# EAGLE design IO_board-ha-v2 (EAGLE 6.5.0)
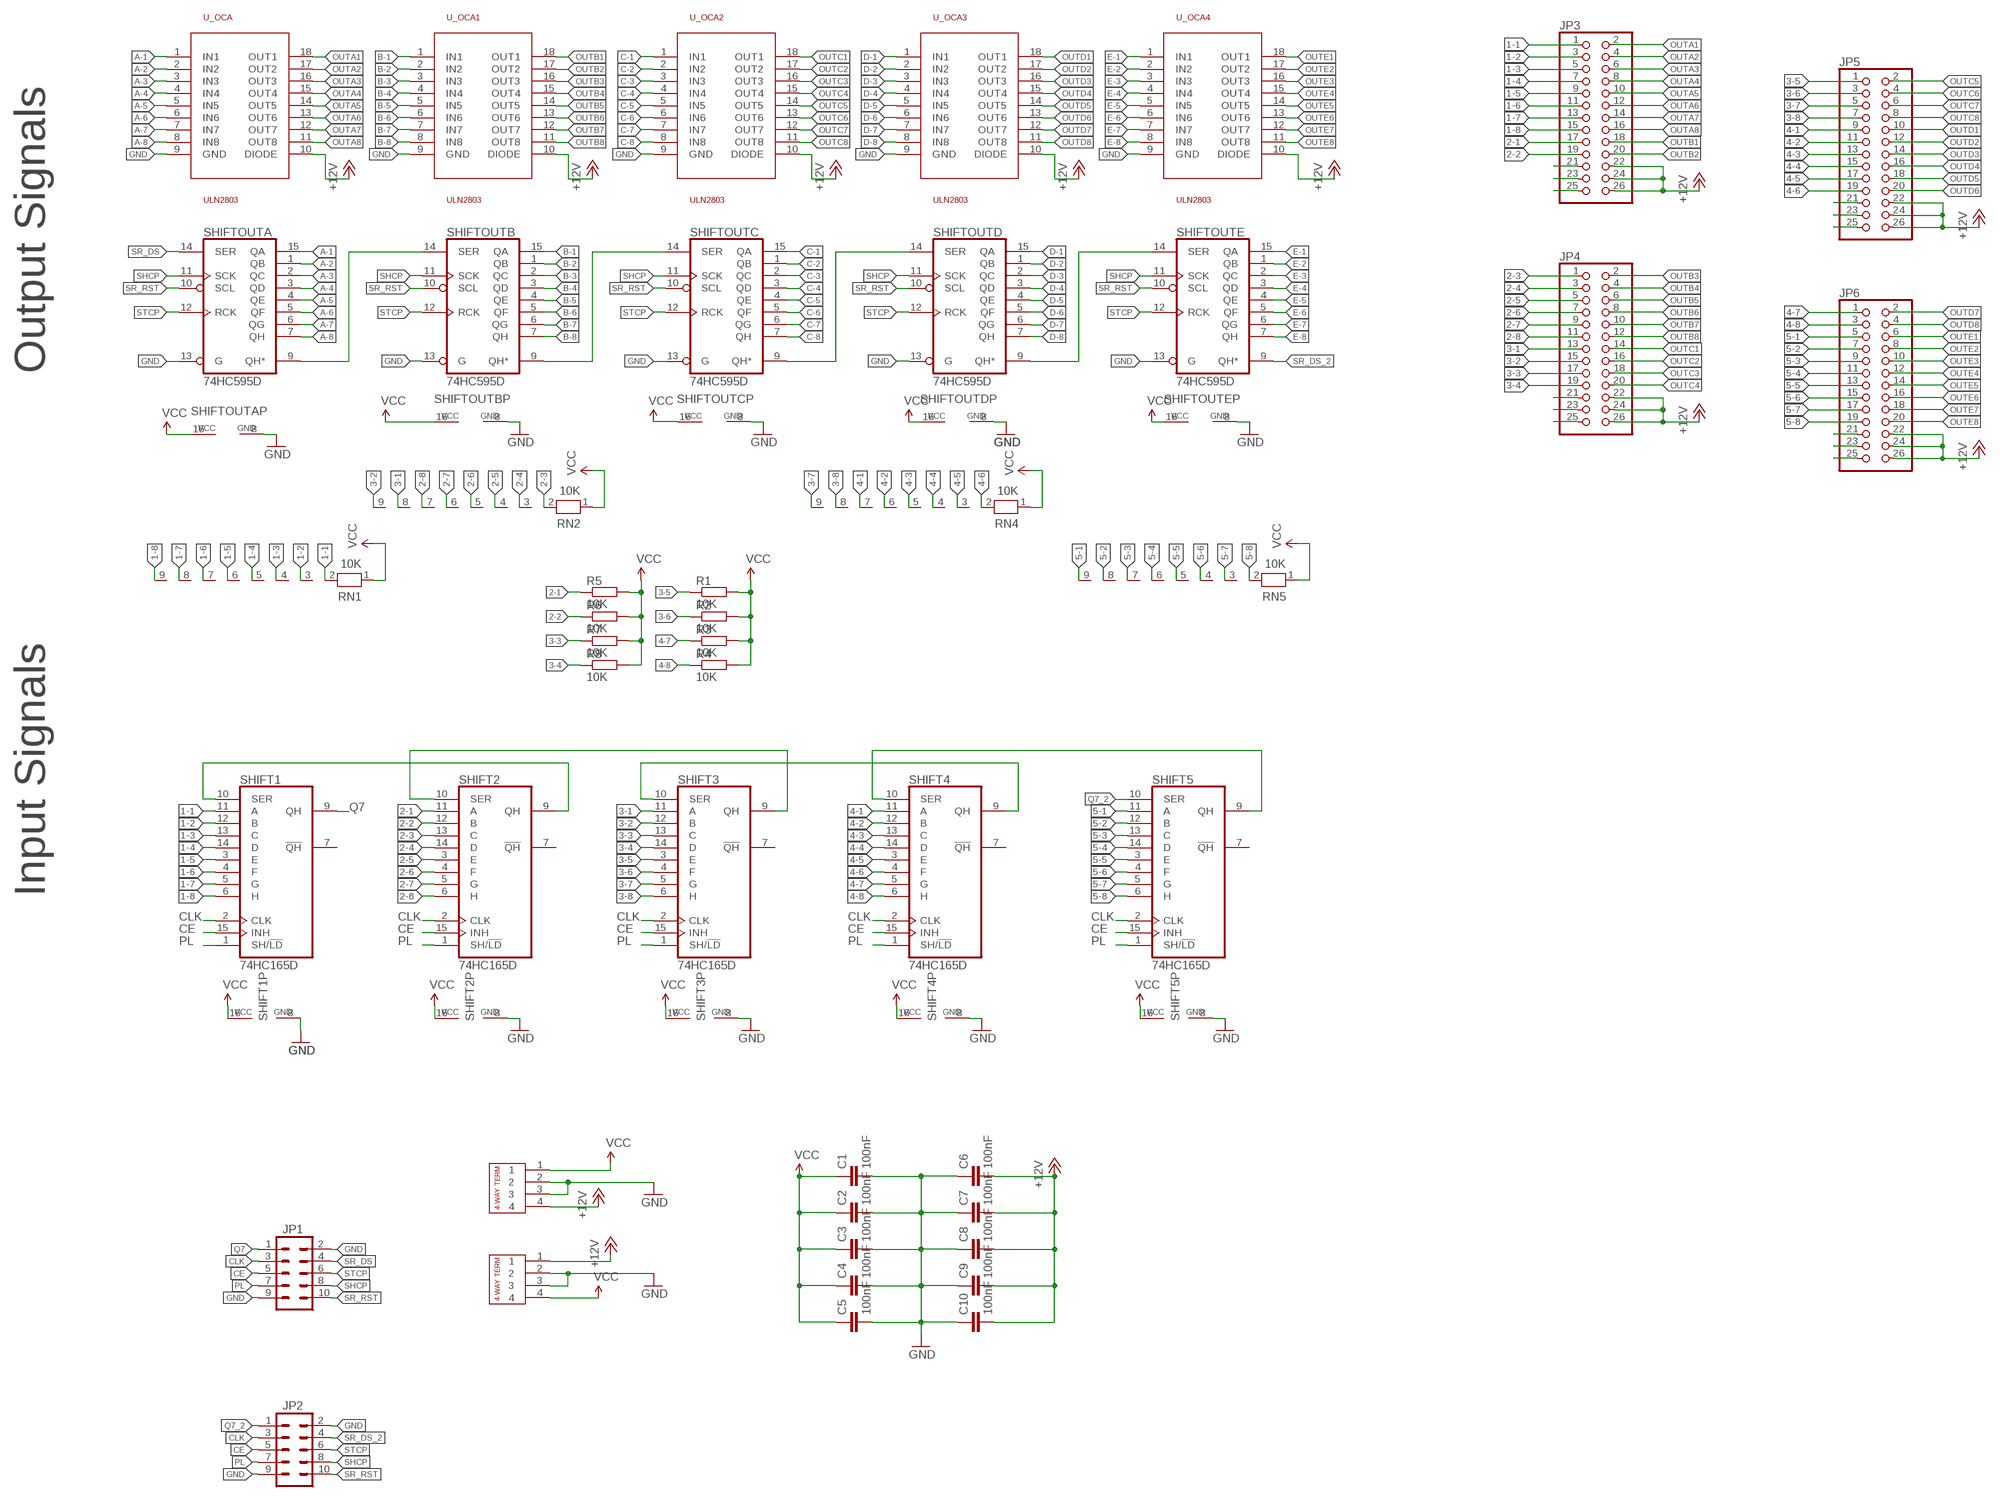
[diagram p0: schematic, sheet 1]

## Parts
C1  100nF  C-EUC0805  [C0805]
C2  100nF  C-EUC0805  [C0805]
C3  100nF  C-EUC0805  [C0805]
C4  100nF  C-EUC0805  [C0805]
C5  100nF  C-EUC0805  [C0805]
C6  100nF  C-EUC0805  [C0805]
C7  100nF  C-EUC0805  [C0805]
C8  100nF  C-EUC0805  [C0805]
C9  100nF  C-EUC0805  [C0805]
C10  100nF  C-EUC0805  [C0805]
J1  4-PIN-CON-1759017  [4-PIN-CON-1759017]
J2  4-PIN-CON-1759017  [4-PIN-CON-1759017]
JP1  M05X2SHD  [2X5-SHROUDED]
JP2  M05X2SHD  [2X5-SHROUDED]
JP3  PINHD-2X13  [2X13]
JP4  PINHD-2X13  [2X13]
JP5  PINHD-2X13  [2X13]
JP6  PINHD-2X13  [2X13]
R1  10K  R-EU_R0603  [R0603]
R2  10K  R-EU_R0603  [R0603]
R3  10K  R-EU_R0603  [R0603]
R4  10K  R-EU_R0603  [R0603]
R5  10K  R-EU_R0603  [R0603]
R6  10K  R-EU_R0603  [R0603]
R7  10K  R-EU_R0603  [R0603]
R8  10K  R-EU_R0603  [R0603]
RN1  10K  RN08  [RN-9]
RN2  10K  RN08  [RN-9]
RN4  10K  RN08  [RN-9]
RN5  10K  RN08  [RN-9]
SHIFT1  74HC165D  [SO16]
SHIFT2  74HC165D  [SO16]
SHIFT3  74HC165D  [SO16]
SHIFT4  74HC165D  [SO16]
SHIFT5  74HC165D  [SO16]
SHIFTOUTA  74HC595D  [SO16]
SHIFTOUTB  74HC595D  [SO16]
SHIFTOUTC  74HC595D  [SO16]
SHIFTOUTD  74HC595D  [SO16]
SHIFTOUTE  74HC595D  [SO16]
U_OCA  ULN2803  [SO18L]
U_OCA1  ULN2803  [SO18L]
U_OCA2  ULN2803  [SO18L]
U_OCA3  ULN2803  [SO18L]
U_OCA4  ULN2803  [SO18L]

## Nets
1-1: JP3.1 RN1.2 SHIFT1.11(A)
1-2: JP3.3 RN1.3 SHIFT1.12(B)
1-3: JP3.5 RN1.4 SHIFT1.13(C)
1-4: JP3.7 RN1.5 SHIFT1.14(D)
1-5: JP3.9 RN1.6 SHIFT1.3(E)
1-6: JP3.11 RN1.7 SHIFT1.4(F)
1-7: JP3.13 RN1.8 SHIFT1.5(G)
1-8: JP3.15 RN1.9 SHIFT1.6(H)
2-1: JP3.17 R5.1 SHIFT2.11(A)
2-2: JP3.19 R6.1 SHIFT2.12(B)
2-3: JP4.1 RN2.2 SHIFT2.13(C)
2-4: JP4.3 RN2.3 SHIFT2.14(D)
2-5: JP4.5 RN2.4 SHIFT2.3(E)
2-6: JP4.7 RN2.5 SHIFT2.4(F)
2-7: JP4.9 RN2.6 SHIFT2.5(G)
2-8: JP4.11 RN2.7 SHIFT2.6(H)
3-1: JP4.13 RN2.8 SHIFT3.11(A)
3-2: JP4.15 RN2.9 SHIFT3.12(B)
3-3: JP4.17 R7.1 SHIFT3.13(C)
3-4: JP4.19 R8.1 SHIFT3.14(D)
3-5: JP5.1 R1.1 SHIFT3.3(E)
3-6: JP5.3 R2.1 SHIFT3.4(F)
3-7: JP5.5 RN4.9 SHIFT3.5(G)
3-8: JP5.7 RN4.8 SHIFT3.6(H)
4-1: JP5.9 RN4.7 SHIFT4.11(A)
4-2: JP5.11 RN4.6 SHIFT4.12(B)
4-3: JP5.13 RN4.5 SHIFT4.13(C)
4-4: JP5.15 RN4.4 SHIFT4.14(D)
4-5: JP5.17 RN4.3 SHIFT4.3(E)
4-6: JP5.19 RN4.2 SHIFT4.4(F)
4-7: JP6.1 R3.1 SHIFT4.5(G)
4-8: JP6.3 R4.1 SHIFT4.6(H)
5-1: JP6.5 RN5.9 SHIFT5.11(A)
5-2: JP6.7 RN5.8 SHIFT5.12(B)
5-3: JP6.9 RN5.7 SHIFT5.13(C)
5-4: JP6.11 RN5.6 SHIFT5.14(D)
5-5: JP6.13 RN5.5 SHIFT5.3(E)
5-6: JP6.15 RN5.4 SHIFT5.4(F)
5-7: JP6.17 RN5.3 SHIFT5.5(G)
5-8: JP6.19 RN5.2 SHIFT5.6(H)
+12V [power]: C6.2 C7.2 C8.2 C9.2 C10.2 J1.4 J2.1 JP3.22 JP3.24 JP3.26 JP4.22 JP4.24 JP4.26 JP5.22 JP5.24 JP5.26 JP6.22 JP6.24 JP6.26 U_OCA1.10(DIODE) U_OCA2.10(DIODE) U_OCA3.10(DIODE) U_OCA4.10(DIODE) U_OCA.10(DIODE)
A-1: SHIFTOUTA.15(QA) U_OCA.1(IN1)
A-2: SHIFTOUTA.1(QB) U_OCA.2(IN2)
A-3: SHIFTOUTA.2(QC) U_OCA.3(IN3)
A-4: SHIFTOUTA.3(QD) U_OCA.4(IN4)
A-5: SHIFTOUTA.4(QE) U_OCA.5(IN5)
A-6: SHIFTOUTA.5(QF) U_OCA.6(IN6)
A-7: SHIFTOUTA.6(QG) U_OCA.7(IN7)
A-8: SHIFTOUTA.7(QH) U_OCA.8(IN8)
B-1: SHIFTOUTB.15(QA) U_OCA1.1(IN1)
B-2: SHIFTOUTB.1(QB) U_OCA1.2(IN2)
B-3: SHIFTOUTB.2(QC) U_OCA1.3(IN3)
B-4: SHIFTOUTB.3(QD) U_OCA1.4(IN4)
B-5: SHIFTOUTB.4(QE) U_OCA1.5(IN5)
B-6: SHIFTOUTB.5(QF) U_OCA1.6(IN6)
B-7: SHIFTOUTB.6(QG) U_OCA1.7(IN7)
B-8: SHIFTOUTB.7(QH) U_OCA1.8(IN8)
C-1: SHIFTOUTC.15(QA) U_OCA2.1(IN1)
C-2: SHIFTOUTC.1(QB) U_OCA2.2(IN2)
C-3: SHIFTOUTC.2(QC) U_OCA2.3(IN3)
C-4: SHIFTOUTC.3(QD) U_OCA2.4(IN4)
C-5: SHIFTOUTC.4(QE) U_OCA2.5(IN5)
C-6: SHIFTOUTC.5(QF) U_OCA2.6(IN6)
C-7: SHIFTOUTC.6(QG) U_OCA2.7(IN7)
C-8: SHIFTOUTC.7(QH) U_OCA2.8(IN8)
CE: JP1.5 JP2.5 SHIFT1.15(INH) SHIFT2.15(INH) SHIFT3.15(INH) SHIFT4.15(INH) SHIFT5.15(INH)
CLK: JP1.3 JP2.3 SHIFT1.2(CLK) SHIFT2.2(CLK) SHIFT3.2(CLK) SHIFT4.2(CLK) SHIFT5.2(CLK)
D-1: SHIFTOUTD.15(QA) U_OCA3.1(IN1)
D-2: SHIFTOUTD.1(QB) U_OCA3.2(IN2)
D-3: SHIFTOUTD.2(QC) U_OCA3.3(IN3)
D-4: SHIFTOUTD.3(QD) U_OCA3.4(IN4)
D-5: SHIFTOUTD.4(QE) U_OCA3.5(IN5)
D-6: SHIFTOUTD.5(QF) U_OCA3.6(IN6)
D-7: SHIFTOUTD.6(QG) U_OCA3.7(IN7)
D-8: SHIFTOUTD.7(QH) U_OCA3.8(IN8)
E-1: SHIFTOUTE.15(QA) U_OCA4.1(IN1)
E-2: SHIFTOUTE.1(QB) U_OCA4.2(IN2)
E-3: SHIFTOUTE.2(QC) U_OCA4.3(IN3)
E-4: SHIFTOUTE.3(QD) U_OCA4.4(IN4)
E-5: SHIFTOUTE.4(QE) U_OCA4.5(IN5)
E-6: SHIFTOUTE.5(QF) U_OCA4.6(IN6)
E-7: SHIFTOUTE.6(QG) U_OCA4.7(IN7)
E-8: SHIFTOUTE.7(QH) U_OCA4.8(IN8)
GND [GND]: C1.2 C2.2 C3.2 C4.2 C5.2 C6.1 C7.1 C8.1 C9.1 C10.1 J1.2 J1.3 J2.2 J2.3 JP1.2 JP1.9 JP2.2 JP2.9 JP3.21 JP3.23 JP3.25 JP4.21 JP4.23 JP4.25 JP5.21 JP5.23 JP5.25 JP6.21 JP6.23 JP6.25 SHIFT1.8(GND) SHIFT2.8(GND) SHIFT3.8(GND) SHIFT4.8(GND) SHIFT5.8(GND) SHIFTOUTA.8(GND) SHIFTOUTA.13(G) SHIFTOUTB.8(GND) SHIFTOUTB.13(G) SHIFTOUTC.8(GND) SHIFTOUTC.13(G) SHIFTOUTD.8(GND) SHIFTOUTD.13(G) SHIFTOUTE.8(GND) SHIFTOUTE.13(G) U_OCA1.9(GND) U_OCA2.9(GND) U_OCA3.9(GND) U_OCA4.9(GND) U_OCA.9(GND)
N$18: SHIFT2.10(SER) SHIFT3.9(QH)
N$21: SHIFT3.10(SER) SHIFT4.9(QH)
N$22: SHIFT4.10(SER) SHIFT5.9(QH)
N$26: SHIFTOUTA.9(QH*) SHIFTOUTB.14(SER)
N$31: SHIFTOUTC.9(QH*) SHIFTOUTD.14(SER)
N$37: SHIFTOUTB.9(QH*) SHIFTOUTC.14(SER)
N$38: SHIFTOUTD.9(QH*) SHIFTOUTE.14(SER)
N$50: SHIFT1.10(SER) SHIFT2.9(QH)
OUTA1: JP3.2 U_OCA.18(OUT1)
OUTA2: JP3.4 U_OCA.17(OUT2)
OUTA3: JP3.6 U_OCA.16(OUT3)
OUTA4: JP3.8 U_OCA.15(OUT4)
OUTA5: JP3.10 U_OCA.14(OUT5)
OUTA6: JP3.12 U_OCA.13(OUT6)
OUTA7: JP3.14 U_OCA.12(OUT7)
OUTA8: JP3.16 U_OCA.11(OUT8)
OUTB1: JP3.18 U_OCA1.18(OUT1)
OUTB2: JP3.20 U_OCA1.17(OUT2)
OUTB3: JP4.2 U_OCA1.16(OUT3)
OUTB4: JP4.4 U_OCA1.15(OUT4)
OUTB5: JP4.6 U_OCA1.14(OUT5)
OUTB6: JP4.8 U_OCA1.13(OUT6)
OUTB7: JP4.10 U_OCA1.12(OUT7)
OUTB8: JP4.12 U_OCA1.11(OUT8)
OUTC1: JP4.14 U_OCA2.18(OUT1)
OUTC2: JP4.16 U_OCA2.17(OUT2)
OUTC3: JP4.18 U_OCA2.16(OUT3)
OUTC4: JP4.20 U_OCA2.15(OUT4)
OUTC5: JP5.2 U_OCA2.14(OUT5)
OUTC6: JP5.4 U_OCA2.13(OUT6)
OUTC7: JP5.6 U_OCA2.12(OUT7)
OUTC8: JP5.8 U_OCA2.11(OUT8)
OUTD1: JP5.10 U_OCA3.18(OUT1)
OUTD2: JP5.12 U_OCA3.17(OUT2)
OUTD3: JP5.14 U_OCA3.16(OUT3)
OUTD4: JP5.16 U_OCA3.15(OUT4)
OUTD5: JP5.18 U_OCA3.14(OUT5)
OUTD6: JP5.20 U_OCA3.13(OUT6)
OUTD7: JP6.2 U_OCA3.12(OUT7)
OUTD8: JP6.4 U_OCA3.11(OUT8)
OUTE1: JP6.6 U_OCA4.18(OUT1)
OUTE2: JP6.8 U_OCA4.17(OUT2)
OUTE3: JP6.10 U_OCA4.16(OUT3)
OUTE4: JP6.12 U_OCA4.15(OUT4)
OUTE5: JP6.14 U_OCA4.14(OUT5)
OUTE6: JP6.16 U_OCA4.13(OUT6)
OUTE7: JP6.18 U_OCA4.12(OUT7)
OUTE8: JP6.20 U_OCA4.11(OUT8)
PL: JP1.7 JP2.7 SHIFT1.1(SH/!LD) SHIFT2.1(SH/!LD) SHIFT3.1(SH/!LD) SHIFT4.1(SH/!LD) SHIFT5.1(SH/!LD)
Q7: JP1.1 SHIFT1.9(QH)
Q7_2: JP2.1 SHIFT5.10(SER)
SHCP: JP1.8 JP2.8 SHIFTOUTA.11(SCK) SHIFTOUTB.11(SCK) SHIFTOUTC.11(SCK) SHIFTOUTD.11(SCK) SHIFTOUTE.11(SCK)
SR_DS: JP1.4 SHIFTOUTA.14(SER)
SR_DS_2: JP2.4 SHIFTOUTE.9(QH*)
SR_RST: JP1.10 JP2.10 SHIFTOUTA.10(SCL) SHIFTOUTB.10(SCL) SHIFTOUTC.10(SCL) SHIFTOUTD.10(SCL) SHIFTOUTE.10(SCL)
STCP: JP1.6 JP2.6 SHIFTOUTA.12(RCK) SHIFTOUTB.12(RCK) SHIFTOUTC.12(RCK) SHIFTOUTD.12(RCK) SHIFTOUTE.12(RCK)
VCC [power]: C1.1 C2.1 C3.1 C4.1 C5.1 J1.1 J2.4 R1.2 R2.2 R3.2 R4.2 R5.2 R6.2 R7.2 R8.2 RN1.1 RN2.1 RN4.1 RN5.1 SHIFT1.16(VCC) SHIFT2.16(VCC) SHIFT3.16(VCC) SHIFT4.16(VCC) SHIFT5.16(VCC) SHIFTOUTA.16(VCC) SHIFTOUTB.16(VCC) SHIFTOUTC.16(VCC) SHIFTOUTD.16(VCC) SHIFTOUTE.16(VCC)
Unconnected: SHIFT1.7(!QH) SHIFT2.7(!QH) SHIFT3.7(!QH) SHIFT4.7(!QH) SHIFT5.7(!QH)

## Notes on the sheet
- Output Signals
- Input Signals

## Library data of the parts
C1-C10 = resistor:C-EU: CAPACITOR, European symbol
J1 J2 = maul:4-PIN-CON-1759017
JP1 JP2 = SparkFun-Connectors:M05X2: Header 5x2 Standard 10-pin dual row 0.1" header. Commonly used with AVR-ISP. Use with Spark Fun Electronics SKU: PRT-00778
JP3-JP6 = pinhead:PINHD-2X13: PIN HEADER
R1-R8 = resistor:R-EU_: RESISTOR, European symbol
RN1 RN2 RN4 RN5 = resistor-net:RN08: RESISTOR NETWORK; OC_FARNELL: unknown; OC_NEWARK: unknown
SHIFT1-SHIFT5 = 74xx-eu:74*165: 8-bit parallel load SHIFT REGISTER
SHIFTOUTA SHIFTOUTB SHIFTOUTC SHIFTOUTD SHIFTOUTE = 74xx-eu:74*595: 8-bit SHIFT REGISTER, output latch
U_OCA U_OCA1-U_OCA4 = uln2803:ULN2803

## Net classes
1 power: width 0.305 mm, drill 0.6 mm, clearance 0.813 mm
2 GND: width 0.305 mm, drill 0.6 mm, clearance 0.508 mm
3 LIVEAC: width 0.508 mm, drill 0.508 mm, clearance 1.27 mm

## Board
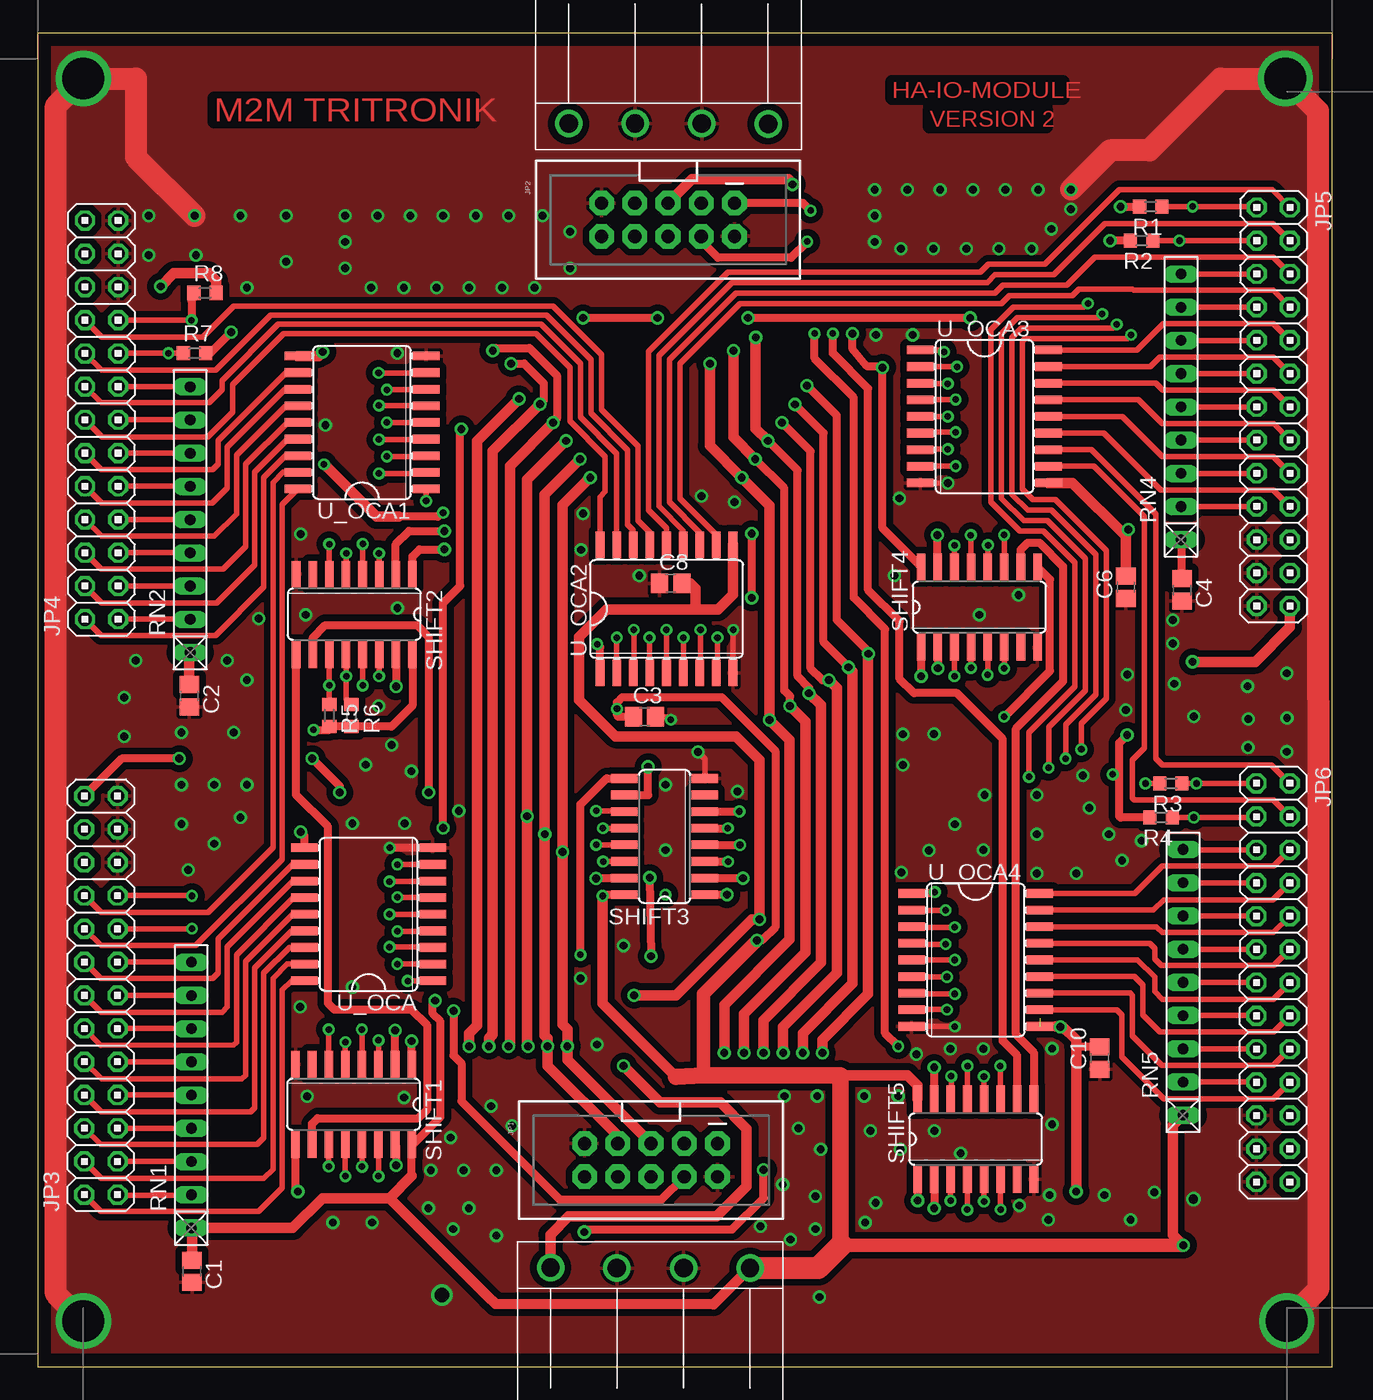
[diagram p1: board, top side]
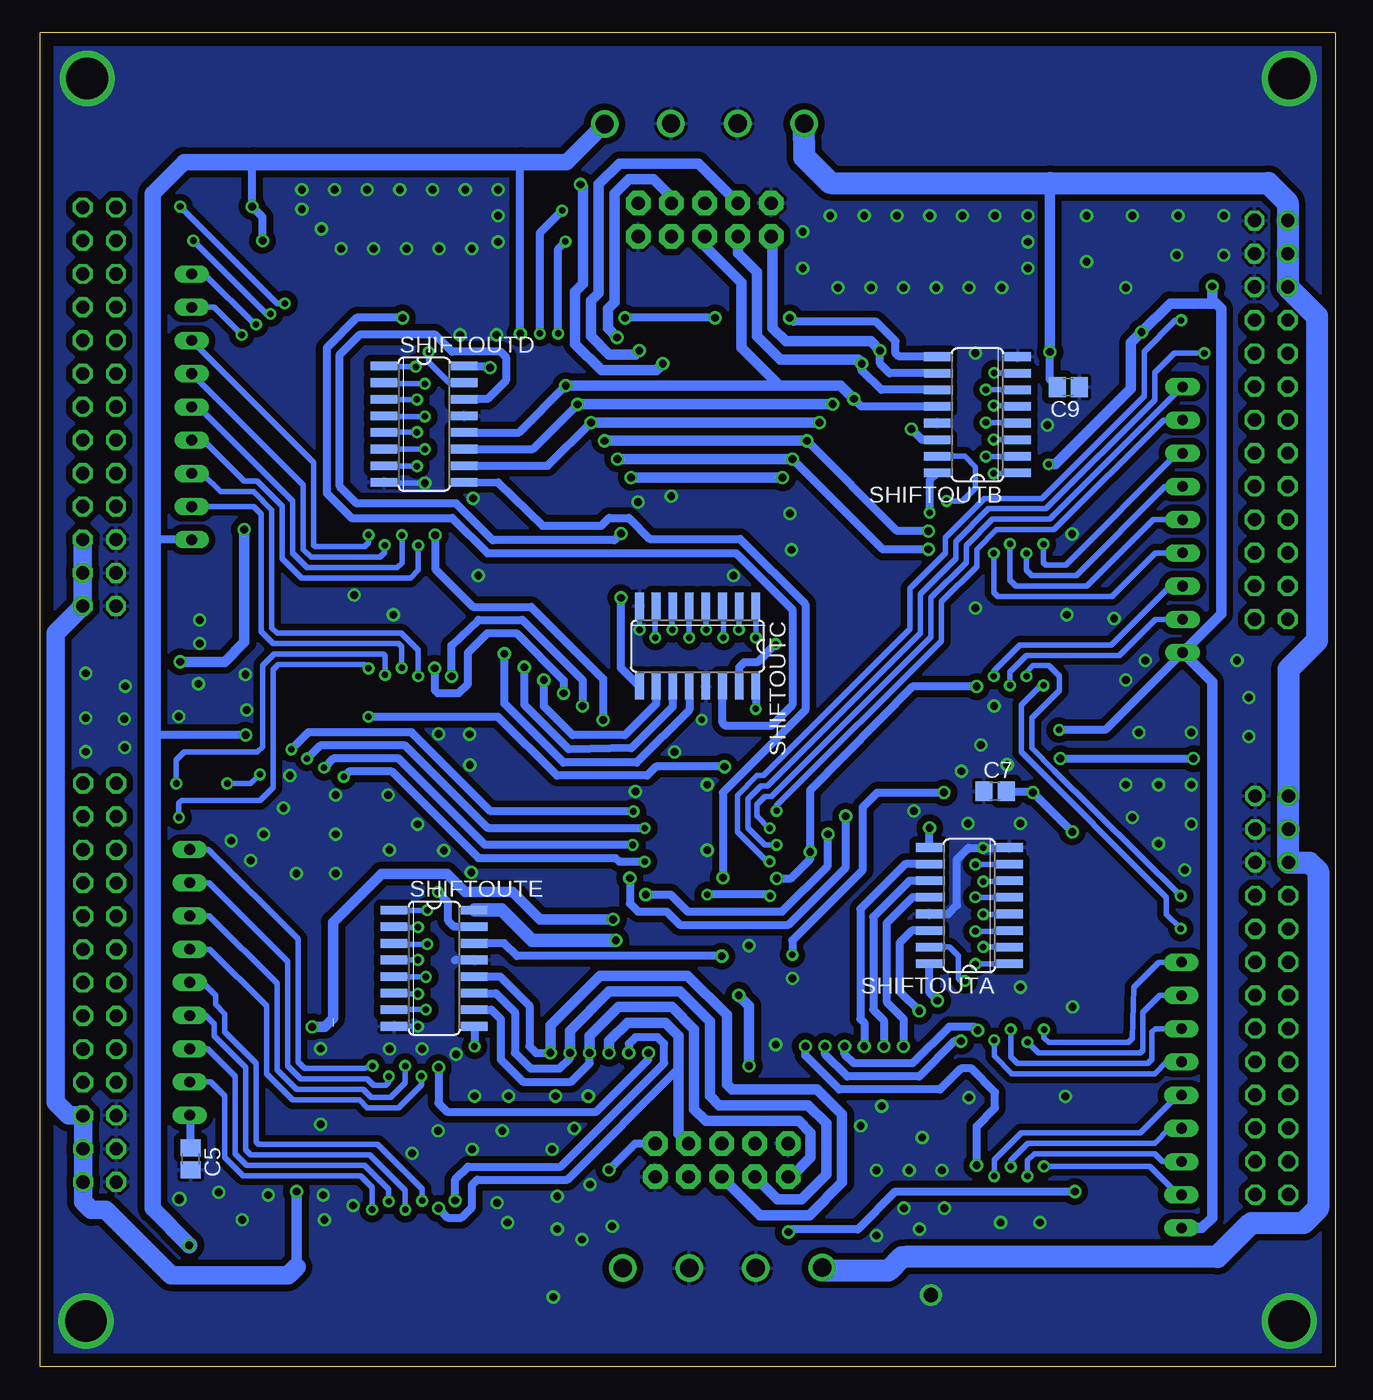
[diagram p2: board, bottom side, seen from below]

Size 99 x 102 mm. Coordinates in mm from the lower left corner, seen from the top.
Outline: 99,0 99,102 0,102 0,0 99,0
Copper layers (1*16): Top 0.035mm / dielectric 1.5mm / Bottom 0.035mm
Design rules "default": minimum track width 10mil, minimum drill 24mil, track to track 8mil, track to pad 8mil, pad to pad 8mil, via to via 8mil, smd to smd 8mil, copper to edge 40mil, drill to drill 8mil, minimum pad ring 10mil, minimum via ring 8mil, stop-mask expansion 4mil, vias tented up to drill 0mil, thermal gap 10mil

### Footprints (pad centres in the part's own frame; a part is rotated, then mirrored left to right if it is on the bottom)
C0805 = smd 1.3 x 1.5: 1 -0.85,0; 2 0.85,0
4-PIN-CON-1759017 = drill 1.4: 1 -7.62,4.13; 2 -2.55,4.1; 3 2.55,4.1; 4 7.63,4.1
2X5-SHROUDED = drill 1.016 pad 1.88 octagon: 1 -1.27,5.08; 2 1.27,5.08; 3 -1.27,2.54; 4 1.27,2.54; 5 -1.27,0; 6 1.27,0; 7 -1.27,-2.54; 8 1.27,-2.54; 9 -1.27,-5.08; 10 1.27,-5.08
2X13 = drill 1.016 octagon: 1 -15.24,-1.27; 2 -15.24,1.27; 3 -12.7,-1.27; 4 -12.7,1.27; 5 -10.16,-1.27; 6 -10.16,1.27; 7 -7.62,-1.27; 8 -7.62,1.27; 9 -5.08,-1.27; 10 -5.08,1.27; 11 -2.54,-1.27; 12 -2.54,1.27; 13 0,-1.27; 14 0,1.27; 15 2.54,-1.27; 16 2.54,1.27; 17 5.08,-1.27; 18 5.08,1.27; 19 7.62,-1.27; 20 7.62,1.27; 21 10.16,-1.27; 22 10.16,1.27; 23 12.7,-1.27; 24 12.7,1.27; 25 15.24,-1.27; 26 15.24,1.27
R0603 = smd 1 x 1.1: 1 -0.85,0; 2 0.85,0
RN-9 = drill 0.813 long: 1 -10.16,0; 2 -7.62,0; 3 -5.08,0; 4 -2.54,0; 5 0,0; 6 2.54,0; 7 5.08,0; 8 7.62,0; 9 10.16,0
SO16 = smd 0.66 x 2.032: 1 -4.445,-3.073; 2 -3.175,-3.073; 3 -1.905,-3.073; 4 -0.635,-3.073; 5 0.635,-3.073; 6 1.905,-3.073; 7 3.175,-3.073; 8 4.445,-3.073; 9 4.445,3.073; 10 3.175,3.073; 11 1.905,3.073; 12 0.635,3.073; 13 -0.635,3.073; 14 -1.905,3.073; 15 -3.175,3.073; 16 -4.445,3.073
SO18L = smd 0.66 x 2.032: 1 -5.08,-4.902; 2 -3.81,-4.902; 3 -2.54,-4.902; 4 -1.27,-4.902; 5 0,-4.902; 6 1.27,-4.902; 7 2.54,-4.902; 8 3.81,-4.902; 9 5.08,-4.902; 10 5.08,4.902; 11 3.81,4.902; 12 2.54,4.902; 13 1.27,4.902; 14 0,4.902; 15 -1.27,4.902; 16 -2.54,4.902; 17 -3.81,4.902; 18 -5.08,4.902

### Placement (x,y rotation side)
C1  11.8,7.3 270 top
C2  11.6,51.3 270 top
C3  46.4,49.7 0 top
C4  87.5,59.4 270 top
C5  87.5,15.9 270 bottom
C6  83.2,59.6 90 top
C7  26,44 0 bottom
C8  48.4,59.9 0 top
C9  20.4,74.9 180 bottom
C10  81.2,23.6 90 top
J1  48.23,99.15 180 top
J2  46.84,3.45 0 top
JP1  46.9,15.8 270 top
JP2  48.2,87.7 270 top
JP3  4.84,28.4 90 top
JP4  4.89,72.4 90 top
JP5  94.48,73.4 270 top
JP6  94.46,29.37 270 top
R1  85.1,88.7 180 top
R2  84.4,86.1 180 top
R3  86.64,44.6 180 top
R4  85.9,42 180 top
R5  22.3,49.8 270 top
R6  24,49.8 270 top
R7  12,77.5 0 top
R8  12.8,82.1 0 top
RN1  11.75,20.77 90 top
RN2  11.66,64.77 90 top
RN4  87.42,73.39 90 top
RN5  87.57,29.39 90 top
SHIFT1  24.16,20.06 180 top
SHIFT2  24.21,57.53 180 top
SHIFT3  47.94,40.54 90 top
SHIFT4  72,58.08 0 top
SHIFT5  71.72,17.41 0 top
SHIFTOUTA  27.96,35.26 90 bottom
SHIFTOUTB  27.34,72.79 90 bottom
SHIFTOUTC  48.74,55.09 180 bottom
SHIFTOUTD  69.65,72.07 270 bottom
SHIFTOUTE  68.88,30.47 270 bottom
U_OCA  25.3,34.6 90 top
U_OCA1  24.8,72.2 90 top
U_OCA2  48.08,57.95 0 top
U_OCA3  72.39,72.66 270 top
U_OCA4  71.72,31.11 270 top

### Tracks (layer width: path | path; a pad name or v marks a point on that pad's centre or on a via)
1-1  (via drill 0.5)
  Top 0.406: SHIFT1.11 v22.25,15.32 | JP3.1 6.34,13.16 6.4,13.1 11.7,13.1 RN1.2
  Bottom 0.406: v22.25,15.32 14.18,15.32 11.98,13.15 RN1.2
1-2  (via drill 0.5)
  Top 0.406: SHIFT1.12 v23.52,14.57 | JP3.3 RN1.3
  Bottom 0.406: v23.52,14.57 23.52,15.78 23,16.3 13.8,16.3 13.2,15.7 RN1.3
1-3  (via drill 0.5)
  Top 0.406: SHIFT1.13 v24.8,15.3 | JP3.5 RN1.4
  Bottom 0.406: v24.8,15.3 24.8,15.8 23.5,17.1 13.8,17.1 12.67,18.23 RN1.4
1-4  (via drill 0.5)
  Top 0.406: SHIFT1.14 v26.07,14.56 | JP3.7 RN1.5
  Bottom 0.406: v26.07,14.56 26.07,15.84 24,17.9 14.9,17.9 12.03,20.77 RN1.5
1-5  (via drill 0.5)
  Top 0.406: SHIFT1.3 v26.07,24.96 | JP3.9 RN1.6
  Bottom 0.406: v26.07,24.96 26.07,23.77 24.7,22.4 13.8,22.4 12.89,23.31 RN1.6
1-6  (via drill 0.5)
  Top 0.406: SHIFT1.4 v24.8,25.8 | JP3.11 RN1.7
  Bottom 0.406: v24.8,25.8 24.8,23.7 24.3,23.2 14.3,23.2 14,23.5 14,25.6 13.75,25.85 RN1.7 12.05,25.85
1-7  (via drill 0.5)
  Top 0.406: SHIFT1.5 v23.52,24.82 | JP3.13 RN1.8
  Bottom 0.406: v23.52,24.82 22.7,24 14.9,24 14.7,24.2 14.7,27.1 13.4,28.4 RN1.8 11.91,28.39
1-8  (via drill 0.5)
  Top 0.406: SHIFT1.6 v22.25,25.8 | JP3.15 RN1.9
  Bottom 0.406: v22.25,25.8 22.25,25.16 21.9,24.8 15.8,24.8 15.5,25.1 15.4,29 13.47,30.93 RN1.9 11.97,30.93
2-1  (via drill 0.5)
  Top 0.406: v11.8,33.5 11.78,33.48 JP3.17 | SHIFT2.11 v22.3,52.1 R5.1
  Bottom 0.406: v22.3,52.1 22.5,52.1 24,50.6 24,47 12.9,35.9 12.9,34.6 v11.8,33.5
2-2  (via drill 0.5)
  Top 0.406: SHIFT2.12 23.6,54.46 v23.6,52.8 23.6,51.05 R6.1 | v11.8,36 11.42,36.02 JP3.19
  Bottom 0.406: v23.6,52.8 23.6,53.1 23.1,53.6 21.9,53.6 21.1,52.8 21.1,51.7 23.2,49.6 23.2,47.3 21.5,45.6 v11.8,36
2-3  (via drill 0.5)
  Top 0.406: JP4.1 RN2.2 | SHIFT2.13 24.86,54.44 v24.86,52.1
  Bottom 0.406: v24.86,52.1 24.86,53.14 23.6,54.4 16.5,54.4 13.75,57.15 RN2.2
2-4  (via drill 0.5)
  Top 0.406: JP4.3 RN2.3 | SHIFT2.14 26.1,54.44 v26.1,52.8
  Bottom 0.406: v26.1,52.8 26.1,53.2 24.1,55.2 17.1,55.2 12.6,59.7 RN2.3
2-5  (via drill 0.5)
  Top 0.406: JP4.5 RN2.4 | SHIFT2.3 26.1,60.62 v26.1,62.2
  Bottom 0.406: v26.1,62.2 26.1,59.2 25.8,58.9 17.06,58.9 13.73,62.23 RN2.4
2-6  (via drill 0.5)
  Top 0.406: JP4.7 RN2.5 | SHIFT2.4 24.86,60.62 v24.86,62.91
  Bottom 0.406: v24.86,62.91 24.86,60.16 24.4,59.7 18.97,59.7 13.9,64.77 RN2.5
2-7  (via drill 0.5)
  Top 0.406: JP4.9 RN2.6 | SHIFT2.5 23.6,60.63 v23.6,62.2
  Bottom 0.406: 11.69,67.31 RN2.6 13,67.3 19.8,60.5 23.2,60.5 23.6,60.9 v23.6,62.2
2-8  (via drill 0.5)
  Top 0.406: JP4.11 RN2.7 | SHIFT2.6 v22.3,62.9
  Bottom 0.406: v22.3,62.9 22.3,61.5 22.1,61.3 20.6,61.3 12.05,69.85 RN2.7
3-1  (via drill 0.5)
  Top 0.406: JP4.13 RN2.8 | SHIFT3.11 44.66,42.45 44.6,42.5 v42.7,42.5
  Bottom 0.406: RN2.8 13.11,72.39 21.5,64 25.9,64 27.4,62.5 27.4,61.2 30.1,58.5 30.1,55.5 42.7,42.9 v42.7,42.5
3-2  (via drill 0.5)
  Top 0.406: JP4.15 RN2.9 | SHIFT3.12 v43.23,41.17
  Bottom 0.406: v43.23,41.17 43.27,41.17 44.2,42.1 44.2,43 43.6,43.6 43.1,43.6 30.9,55.8 30.9,58.8 28.2,61.5 28.2,62.8 26.2,64.8 21.8,64.8 RN2.9
3-3  (via drill 0.5)
  Top 0.406: SHIFT3.13 v42.7,39.91 | JP4.17 6.18,77.5 v10,77.5 R7.1
  Bottom 0.406: v42.7,39.91 43.6,39.91 44.9,41.2 44.9,43.4 43.9,44.4 43.4,44.4 31.7,56.1 31.7,59.1 29,61.8 29,63.1 26.5,65.6 22.1,65.6 13.8,73.9 13.8,76 12.3,77.5 v10,77.5
3-4  (via drill 0.5)
  Top 0.406: SHIFT3.14 v43.23,38.63 | v11.77,80.02 JP4.19
  Top 0.61: R8.1 11.77,81.48 v11.77,80.02
  Bottom 0.406: v43.23,38.63 43.44,38.63 45.7,40.9 45.7,43.7 44.2,45.2 43.7,45.2 32.5,56.4 32.5,59.5 29.8,62.2 29.8,63.4 26.8,66.4 22.4,66.4 14.6,74.2 14.6,77.62 12.2,80.02 v11.77,80.02
3-5  (via drill 0.5)
  Top 0.406: v75.8,45.1 75.8,48.5 79.3,52 79.3,61.5 76.9,63.9 75.1,63.9 72.9,66.1 72.9,79.3 74.6,81 80,81 v80.3,81.3 | v93.15,88.7 v88.3,88.7 R1.1
  Top 0.61: SHIFT3.3 51.03,38.62 v52.79,38.62
  Bottom 0.406: v80.3,81.3 80.9,81.3 v88.3,88.7 | v93.15,88.7 JP5.1
  Bottom 0.61: v75.8,45.1 75.4,45.5 72.1,45.5 65.5,38.9 55,38.9 54.72,38.62 v52.79,38.62
3-6  (via drill 0.5)
  Top 0.406: JP5.3 v87.3,86.1 R2.1 | v81.4,80.5 81.1,80.2 74.9,80.2 73.7,79 73.7,66.4 75.4,64.7 77.2,64.7 80.1,61.8 80.1,51.7 77.3,48.9 v77.3,45.8
  Top 0.61: SHIFT3.4 v53.7,39.9
  Bottom 0.406: v81.4,80.5 81.7,80.5 v87.3,86.1
  Bottom 0.61: v53.7,39.9 65,39.9 71.6,46.5 76.6,46.5 v77.3,45.8
3-7  (via drill 0.5)
  Top 0.406: RN4.9 JP5.5 | v82.5,79.7 82.2,79.4 75.2,79.4 74.5,78.7 74.5,66.7 75.7,65.5 77.5,65.5 80.9,62.1 80.9,51.4 78.6,49.1 v78.6,46.5
  Top 0.61: SHIFT3.5 v52.77,41.17
  Bottom 0.406: v82.5,79.7 82.6,79.7 86.45,83.55 RN4.9
  Bottom 0.61: v52.77,41.17 64.67,41.17 64.7,41.2 64.8,41.2 71.1,47.5 77.6,47.5 v78.6,46.5
3-8  (via drill 0.5)
  Top 0.406: RN4.8 JP5.7 | v83.6,78.9 83.3,78.6 75.5,78.6 75.3,78.4 75.3,67.1 76.1,66.3 77.8,66.3 81.7,62.4 81.7,51.1 79.8,49.2 v79.8,47.2
  Top 0.61: SHIFT3.6 51.03,42.46 v53.65,42.46
  Bottom 0.406: v83.6,78.9 85.71,81.01 RN4.8
  Bottom 0.61: v53.65,42.46 64.56,42.46 70.6,48.5 78.5,48.5 v79.8,47.2
4-1  (via drill 0.5)
  Top 0.406: RN4.7 JP5.9 | SHIFT4.11 73.91,62.99 v73.9,63.6
  Bottom 0.406: v73.9,63.6 73.9,63 74.2,62.7 78,62.7 78.1,62.8 78.1,69.15 RN4.7
4-2  (via drill 0.5)
  Top 0.406: RN4.6 JP5.11 | SHIFT4.12 72.66,61.18 v72.66,62.82
  Bottom 0.406: v72.66,62.82 72.66,62.24 73,61.9 78.3,61.9 78.9,62.5 78.9,67.41 RN4.6
4-3  (via drill 0.5)
  Top 0.406: RN4.5 JP5.13 | SHIFT4.13 71.35,61.17 v71.35,63.59
  Bottom 0.406: v71.35,63.59 71.35,61.45 71.7,61.1 78.6,61.1 79.7,62.2 79.7,66.2 86.89,73.39 RN4.5
4-4  (via drill 0.5)
  Top 0.406: RN4.4 JP5.15 | SHIFT4.14 70.09,62.99 v70.1,62.8
  Bottom 0.406: v70.1,62.8 70.1,60.9 70.7,60.3 79,60.3 80.5,61.8 80.5,65.8 82.4,67.7 83.4,67.7 86.55,70.85 RN4.4
4-5  (via drill 0.5)
  Top 0.406: RN4.3 JP5.17 | SHIFT4.3 v70.1,52.8
  Bottom 0.406: v70.1,52.8 70.1,54.8 71.4,56.1 80.9,56.1 81.3,56.5 81.3,65.5 82.7,66.9 85.2,66.9 86.6,68.3 RN4.3
4-6  (via drill 0.5)
  Top 0.406: RN4.2 JP5.19 | SHIFT4.4 v71.36,53.44
  Bottom 0.406: v71.36,53.44 71.36,55.06 71.6,55.3 81.2,55.3 82.1,56.2 82.1,65.2 82.67,65.77 RN4.2
4-7  (via drill 0.5)
  Top 0.406: SHIFT4.5 v72.64,52.9 | JP6.1 v88.6,44.6 R3.1
  Bottom 0.406: v72.64,52.9 72.64,54.34 72.8,54.5 81.1,54.5 82,53.6 82,47.4 82.4,47 88,47 88.6,46.4 v88.6,44.6
4-8  (via drill 0.5)
  Top 0.406: SHIFT4.6 v73.9,53.4 | JP6.3 93.12,42 v88.4,42 R4.1
  Bottom 0.406: v73.9,53.4 74.2,53.7 80.8,53.7 81.2,53.3 81.2,44.3 82.2,43.3 88.2,43.3 88.4,43.1 v88.4,42
5-1  (via drill 0.5)
  Top 0.406: RN5.9 87.95,39.55 88,39.5 93.16,39.5 JP6.5 | SHIFT5.11 73.6,20.51 v73.6,23
  Bottom 0.406: v73.6,23 74.2,22.8 78.8,22.8 79.3,23.3 79.3,32.7 86.15,39.55 RN5.9
5-2  (via drill 0.5)
  Top 0.406: RN5.8 93.17,37.01 JP6.7 | SHIFT5.12 v72.35,22.2
  Bottom 0.406: v72.35,22.2 72.35,21.75 72.6,21.5 73.5,21.5 74,22 79.1,22 80.1,23 80.1,31 86.1,37 RN5.8
5-3  (via drill 0.5)
  Top 0.406: RN5.7 93.17,34.47 JP6.9 | SHIFT5.13 71.1,20.5 v71.1,23
  Bottom 0.406: v71.1,23 71.1,21.7 72.2,20.6 73.7,20.6 74.3,21.2 79.4,21.2 80.9,22.7 80.9,29.3 86.07,34.47 RN5.7
5-4  (via drill 0.5)
  Top 0.406: RN5.6 93.17,31.93 JP6.11 | SHIFT5.14 69.86,20.53 v69.86,22.21
  Bottom 0.406: v69.86,22.21 69.86,21.54 71.6,19.8 74,19.8 74.6,20.4 79.7,20.4 81.7,22.4 81.7,27.6 86.03,31.93 RN5.6
5-5  (via drill 0.5)
  Top 0.406: RN5.5 93.17,29.39 JP6.13 | SHIFT5.3 69.8,14.32 v69.8,12.7
  Bottom 0.406: v69.8,12.7 69.8,13.6 73.2,17 82.3,17 82.5,17.2 82.5,23.2 84.9,25.6 84.9,27 85.6,27.7 85.6,28.4 86.59,29.39 RN5.5
5-6  (via drill 0.5)
  Top 0.406: RN5.4 93.17,26.85 JP6.15 | SHIFT5.4 v71.08,12.02
  Bottom 0.406: v71.08,12.02 71.08,13.48 73.8,16.2 82.9,16.2 83.3,16.6 83.3,22.9 85.7,25.3 85.7,26.2 86.35,26.85 RN5.4
5-7  (via drill 0.5)
  Top 0.406: RN5.3 93.17,24.31 JP6.17 | SHIFT5.5 v72.36,12.65
  Bottom 0.406: v72.36,12.65 72.36,13.56 74.2,15.4 83.2,15.4 84.1,16.3 84.1,22.2 86.2,24.3 RN5.3
5-8  (via drill 0.5)
  Top 0.406: RN5.2 93.17,21.77 JP6.19 | SHIFT5.6 v73.62,12.03
  Bottom 0.406: v73.62,12.03 73.62,13.72 74.5,14.6 83.5,14.6 84.9,16 84.9,20.7 85.97,21.77 RN5.2
+12V  (via drill 0.6)  (1 unrouted)
  Top 0.61: U_OCA.10 20.4,40.6 v20.1,40.9 | v23.1,43.9 23.1,44.4 v21,46.5 | v10.83,46.5 6.43,46.5 JP3.26 | C10.2 79.45,24.45 79.4,24.5
  Top 0.813: U_OCA2.10 53.16,59.06 52,57.9 50.2,57.9 | 50.2,57.9 43.5,57.9 41.4,55.8 41.4,51 44.2,48.2 53.4,48.2 55.2,46.4 v55.2,34.2 54.6,34.2 48.8,28.4 v45.6,28.4 | v79.4,13.4 79.4,24.5 79.4,25 78.4,26 v78.2,26 77.87,26.03 | U_OCA1.10 21.48,77.28 v21.8,77.6 | U_OCA3.10 79.12,67.58 83.2,63.5 | 83.2,63.5 C6.2 | 83.2,63.5 83.2,63.8 v83.4,64 | v88.3,53.9 93.1,53.9 95.75,56.55 JP5.26 | C8.2 49.9,59.9 50.3,59.5 50.3,58 50.2,57.9 | v44.8,23 47.6,20.2 52.2,20.2 54.2,18.2 54.2,13.8 51.9,11.5 40.6,11.5 39.21,10.11 J2.1
  Bottom 0.406: 32.9,8.4 33.1,8.4
  Bottom 0.61: v20.1,40.9 v23.1,43.9 23.2,44 C7.2 | v21,46.5 v10.83,46.5 | C9.2 21.8,75.45 v21.8,77.6
  Bottom 0.813: v45.6,28.4 44.8,27.6 v44.8,23 | v79.4,13.4 79.4,7.64 | v21.8,77.6 21.8,90.5 | v83.4,64 83.4,55.4 84.9,53.9 v88.3,53.9 | v55.2,34.2 60.8,34.2 62.9,36.3 66.5,36.3 67.9,37.7 72.9,37.7 76.62,33.98 76.62,26.63 77.25,26 v78.2,26
  Bottom 1.422: JP5.22 JP5.24 JP5.26 97.8,56.11 97.8,20.2 96.81,19.21 JP6.22 JP6.24 JP6.26 95.73,12.63 95.1,12 94,12 89,7 80.04,7 79.4,7.64
  Bottom 1.676: 32.9,8.4 9,8.4 6.4,11 2.4,11 1.3,12.1 1.3,37.9 1.96,38.56 JP3.22 JP3.24 JP3.26 3.57,53.33 1.4,55.5 1.4,80.34 JP4.22 JP4.24 JP4.26 3.62,89.02 5.1,90.5 21.8,90.5 38.6,90.5 40.58,92.47 J1.4 | 33.1,8.4 34.16,7.34 39.01,7.34 J2.1
A-1  (via drill 0.5)
  Top 0.406: U_OCA.1 30.18,29.5 v28.3,29.5
  Bottom 0.406: v28.3,29.5 28.6,29.5 28.8,29.7 28.8,31.4 29.48,32.09 SHIFTOUTA.15
A-2  (via drill 0.5)
  Top 0.406: v27.5,30.8 U_OCA.2
  Bottom 0.406: SHIFTOUTA.1 24.87,30.8 v27.5,30.8
A-3  (via drill 0.5)
  Top 0.406: v26.9,32.1 30.16,32.1 U_OCA.3
  Bottom 0.406: SHIFTOUTA.2 24.87,32.1 v26.9,32.1
A-4  (via drill 0.5)
  Top 0.406: v27.5,33.3 30.17,33.3 U_OCA.4
  Bottom 0.406: SHIFTOUTA.3 24.83,33.3 v27.5,33.3
A-5  (via drill 0.5)
  Top 0.406: v26.9,34.6 U_OCA.5
  Bottom 0.406: SHIFTOUTA.4 25.27,34.62 25.3,34.6 v26.9,34.6
A-6  (via drill 0.5)
  Top 0.406: v27.5,35.9 30.17,35.9 U_OCA.6
  Bottom 0.406: SHIFTOUTA.5 v27.5,35.9
A-7  (via drill 0.5)
  Top 0.406: v26.9,37.1 30.16,37.1 U_OCA.7
  Bottom 0.406: SHIFTOUTA.6 24.82,37.1 v26.9,37.1
A-8  (via drill 0.5)
  Top 0.406: v27.5,38.4 U_OCA.8
  Bottom 0.406: SHIFTOUTA.7 24.85,38.4 v27.5,38.4
B-1  (via drill 0.5)
  Top 0.406: v29.7,66.2 U_OCA1.1
  Bottom 0.406: SHIFTOUTB.15 28.32,69.61 27.5,68.8 27.5,67.2 28.5,66.2 v29.7,66.2
B-2  (via drill 0.5)
  Top 0.406: v26.1,68.3 29.61,68.3 U_OCA1.2
  Bottom 0.406: SHIFTOUTB.1 24.22,68.3 v26.1,68.3
B-3  (via drill 0.5)
  Top 0.406: v26.7,69.6 29.64,69.6 U_OCA1.3
  Bottom 0.406: SHIFTOUTB.2 24.25,69.6 v26.7,69.6
B-4  (via drill 0.5)
  Top 0.406: v26.1,70.9 29.67,70.9 U_OCA1.4
  Bottom 0.406: SHIFTOUTB.3 24.25,70.9 v26.1,70.9
B-5  (via drill 0.5)
  Top 0.406: v26.7,72.2 U_OCA1.5
  Bottom 0.406: SHIFTOUTB.4 24.22,72.2 v26.7,72.2
B-6  (via drill 0.5)
  Top 0.406: v26.1,73.5 29.67,73.5 U_OCA1.6
  Bottom 0.406: SHIFTOUTB.5 24.19,73.5 v26.1,73.5
B-7  (via drill 0.5)
  Top 0.406: v26.7,74.7 29.66,74.7 U_OCA1.7
  Bottom 0.406: SHIFTOUTB.6 v26.7,74.7
B-8  (via drill 0.5)
  Top 0.406: v26.07,75.99 29.72,75.99 U_OCA1.8
  Bottom 0.406: SHIFTOUTB.7 24.27,75.99 v26.07,75.99
C-1  (via drill 0.5)
  Top 0.61: U_OCA2.1 43,55.03 v42.78,55.25
  Bottom 0.61: v42.78,55.25 44.18,53.85 45.18,53.85 45.56,53.47 SHIFTOUTC.15
C-2  (via drill 0.5)
  Top 0.406: v44.28,55.75 U_OCA2.2
  Bottom 0.406: SHIFTOUTC.1 44.28,58.18 v44.28,55.75
C-3  (via drill 0.5)
  Top 0.406: v45.58,56.35 45.58,53.09 U_OCA2.3
  Bottom 0.406: SHIFTOUTC.2 45.58,58.18 v45.58,56.35
C-4  (via drill 0.5)
  Top 0.406: v46.78,55.75 46.78,53.08 U_OCA2.4
  Bottom 0.406: SHIFTOUTC.3 46.78,58.22 v46.78,55.75
C-5  (via drill 0.5)
  Top 0.406: v48.08,56.35 U_OCA2.5
  Bottom 0.406: SHIFTOUTC.4 48.08,58.19 v48.08,56.35
C-6  (via drill 0.5)
  Top 0.406: v49.38,55.75 49.38,53.08 U_OCA2.6
  Bottom 0.406: SHIFTOUTC.5 v49.38,55.75
C-7  (via drill 0.5)
  Top 0.406: v50.68,56.35 50.68,53.11 U_OCA2.7
  Bottom 0.406: SHIFTOUTC.6 50.68,58.2 v50.68,56.35
C-8  (via drill 0.5)
  Top 0.406: v51.98,55.75 51.98,53.14 U_OCA2.8
  Bottom 0.406: SHIFTOUTC.7 51.98,58.23 v51.98,55.75
CE  (via drill 0.6)
  Top 0.61: SHIFT1.15 27.4,16.92 v27.4,15.4 | SHIFT3.15 44.85,37.35 v42.69,37.35 | SHIFT5.15 v68.55,22.89 | SHIFT4.15 68.8,61.18 v68.8,63.6 | SHIFT2.15 27.4,54.44 v27.4,52
  Top 0.813: v42.25,67.98 40.14,65.87 v40.14,39.36 40.14,26.16 40.5,25.8 v40.5,24.5 40.5,23.47 JP1.5 | v52.5,24 52.5,27.67 57.5,32.67 57.5,47.93 v55.96,49.46 55.96,65.86 v53.83,67.99 51.4,70.42 v51.4,76.7 | JP2.5 50.03,90.8 57.4,90.8 57.7,90.5 v57.7,90.4
  Bottom 0.61: v42.69,37.35 41.59,37.35 40.14,38.8 v40.14,39.36 40.14,44.06 32.3,52 v27.4,52 | v68.55,22.89 68.55,20.15 67.9,19.5 56.5,19.5 52.5,23.5 v52.5,24 | v68.8,63.6 68.8,61 65.9,58.1 61.46,58.1 55.96,52.6 v55.96,49.46 | v27.4,15.4 27.4,18.4 26,19.8 26,21 27.8,22.8 28.6,22.8 30.2,21.2 37.9,21.2 40.5,23.8 v40.5,24.5
  Bottom 0.813: v53.83,67.99 v53.82,67.98 v42.25,67.98 | v51.4,76.7 51.9,76.2 56.1,76.2 58.1,78.2 58.1,82.2 57.5,82.8 57.5,90.2 v57.7,90.4
CLK  (via drill 0.6)
  Top 0.61: SHIFT1.2 v27.33,25.72 | SHIFT3.2 v53.92,37.36 | SHIFT5.2 v68.55,12.11 | SHIFT4.2 68.84,54.89 v68.84,53.41 | SHIFT2.2 27.39,62.88 28.4,63.9 v31.1,63.9 | v58.99,51.5 58.99,51.91 58.1,52.8 58.1,68.55 v55.85,70.8
  Top 0.813: v40.39,70.8 37.41,67.82 v37.41,42.1 37.41,24.61 37.51,24.51 v37.5,24.5 | v55.5,24 55.5,26.5 59.9,30.9 59.9,50.58 v58.99,51.5 | v54.9,78.7 54.9,71.75 v55.85,70.8
  Bottom 0.61: v27.33,25.72 v27.33,25.73 27.6,26 29.5,26 32.3,23.2 36.8,23.2 37.5,23.9 v37.5,24.5 | v53.92,37.36 53.92,35.42 53.3,34.8 51.1,34.8 50.1,33.8 41.8,33.8 37.41,38.19 v37.41,42.1 | v68.55,12.11 67.84,11.4 66.8,11.4 66,12.2 66,13.9 65.6,14.3 58.7,14.3 50.2,22.8 | v68.84,53.41 68.84,51.74 68.6,51.5 67,51.5 66.3,52.2 66.3,54.6 64.8,56.1 62.6,56.1 58.99,52.49 v58.99,51.5 | v31.1,63.9 33.49,63.9 v40.39,70.8
  Bottom 0.813: v40.39,70.8 v55.85,70.8 | v55.5,24 55.5,24.9 54.1,26.3 51.2,26.3 50.2,25.3 50.2,22.8 50.2,17.83 JP1.3 | v54.9,78.7 55.6,79.4 55.6,80.9 55.1,81.4 55.1,89.7 54,90.8 52.1,90.8 50.74,89.44 JP2.3
D-1  (via drill 0.5)
  Top 0.406: U_OCA3.1 69.26,77.74 v69.3,77.6
  Bottom 0.406: v69.3,77.6 69.3,76.8 67.75,75.25 SHIFTOUTD.15
D-2  (via drill 0.5)
  Top 0.406: v70.29,76.46 66.9,76.46 U_OCA3.2
  Bottom 0.406: SHIFTOUTD.1 72.18,76.46 v70.29,76.46
D-3  (via drill 0.5)
  Top 0.406: v69.59,75.16 66.93,75.16 U_OCA3.3
  Bottom 0.406: SHIFTOUTD.2 72.21,75.16 v69.59,75.16
D-4  (via drill 0.5)
  Top 0.406: v70.19,73.96 66.92,73.96 U_OCA3.4
  Bottom 0.406: SHIFTOUTD.3 72.14,73.96 v70.19,73.96
D-5  (via drill 0.5)
  Top 0.406: v69.59,72.66 U_OCA3.5
  Bottom 0.406: SHIFTOUTD.4 72.77,72.66 v69.59,72.66
D-6  (via drill 0.5)
  Top 0.406: v70.19,71.46 67.56,71.46 U_OCA3.6
  Bottom 0.406: SHIFTOUTD.5 72.75,71.46 v70.19,71.46
D-7  (via drill 0.5)
  Top 0.406: v69.59,70.16 66.93,70.16 U_OCA3.7
  Bottom 0.406: SHIFTOUTD.6 v69.59,70.16
D-8  (via drill 0.5)
  Top 0.406: v70.19,68.86 66.9,68.86 U_OCA3.8
  Bottom 0.406: SHIFTOUTD.7 72.76,68.86 v70.19,68.86
E-1  (via drill 0.5)
  Top 0.61: v68.6,36.3 68.49,36.19 U_OCA4.1
  Bottom 0.61: SHIFTOUTE.15 67.34,33.65 67.8,34.1 67.8,35.5 v68.6,36.3
E-2  (via drill 0.5)
  Top 0.406: v69.42,34.91 U_OCA4.2
  Bottom 0.406: SHIFTOUTE.1 v69.42,34.91
E-3  (via drill 0.5)
  Top 0.406: v70.12,33.61 66.86,33.61 U_OCA4.3
  Bottom 0.406: SHIFTOUTE.2 71.99,33.61 v70.12,33.61
E-4  (via drill 0.5)
  Top 0.406: v69.42,32.31 66.89,32.31 U_OCA4.4
  Bottom 0.406: SHIFTOUTE.3 72.02,32.31 v69.42,32.31
E-5  (via drill 0.5)
  Top 0.406: v70.12,31.11 U_OCA4.5
  Bottom 0.406: SHIFTOUTE.4 v70.12,31.11
E-6  (via drill 0.5)
  Top 0.406: v69.52,29.81 66.85,29.81 U_OCA4.6
  Bottom 0.406: SHIFTOUTE.5 71.98,29.81 v69.52,29.81
E-7  (via drill 0.5)
  Top 0.406: v70.12,28.51 66.88,28.51 U_OCA4.7
  Bottom 0.406: SHIFTOUTE.6 72.01,28.51 v70.12,28.51
E-8  (via drill 0.5)
  Top 0.406: v69.52,27.31 U_OCA4.8
  Bottom 0.406: SHIFTOUTE.7 71.97,27.31 v69.52,27.31
GND  (via drill 0.5, 0.6, 0.7, 1.1, 3.2)
  Top 0.406: v53.18,56.35 53.18,53.07 U_OCA2.9 | v69.59,67.56 66.91,67.56 U_OCA3.9 | v70.12,26.01 66.84,26.01 U_OCA4.9 | C3.2 48.09,49.7 v48.42,49.47 | SHIFT3.8 51.01,46.49 v50.5,47
  Top 0.61: U_OCA.9 v26.92,39.68
  Top 1.676: v95.5,3.5 97.9,5.9 97.88,96.02 v95.4,98.5 90.46,98.5 88.4,96.4 85,93 82,93 v79,90 | v3.5,3.5 1.4,5.6 1.4,96.4 v3.5,98.5 7.5,98.5 7.5,92.5 v12,88
  Bottom 0.406: SHIFTOUTC.8 v53.18,56.35 | SHIFTOUTD.8 72.66,67.56 v69.59,67.56 | SHIFTOUTE.8 71.97,26.01 v70.12,26.01
  Bottom 0.61: SHIFTOUTE.13 67.3,31.11 | SHIFTOUTA.8 24.91,39.68 v26.92,39.68 28.02,39.68 28.9,38.8 28.9,35.3 29.57,34.62 SHIFTOUTA.13
  other vias: 64,90 66.5,90 69,90 71.5,90 74,90 76.5,90 77.5,87 76,85.5 73.5,85.5 71,85.5 68.5,85.5 66,85.5 64,86 64,88 79,88.5 23.5,88 26,88 28.5,88 28.5,88 31,88 31,88 33.5,88 33.5,88 36,88 38.6,88 40.7,86.8 40.7,84 38,82.5 35.5,82.5 33,82.5 30.5,82.5 28,82.5 25.5,82.5 23.5,84 23.5,86 8.5,88 15.5,88 19,88 19,84.5 16,82.5 12.1,85 8.5,85 11,44.5 13.5,44.5 16,44.5 15.5,42 13.5,40 11.5,38 11,41.5 11,48.5 7.5,54 15,48.5 14.5,54 16,52.5 20.5,57.5 20.5,57.5 27.5,58 22,72 27.5,77.5 41.5,29.7 44.8,32.2 48,39.5 48,44.5 53.5,44 66.17,48.36 68.54,48.39 66.16,46.02 68.14,39.49 66.04,37.79 70.14,41.49 72.41,43.72 72.31,39.52 76.41,43.72 76.41,40.72 76.41,37.72 79.41,37.72 82.91,38.72 84.41,40.22 79.91,45.22 80.41,42.72 81.91,40.72 86.91,52.22 88.41,49.72 92.51,52.03 95.51,53.03 95.51,47.03 92.55,47.35 92.57,49.53 95.52,49.6 63.27,11.03 77.37,13.13 68.57,18.03 77.57,18.53 58.17,18.23 56.97,13.93 59.47,13.03 59.47,10.53 57.57,9.73 55.27,10.73 22.57,11.03 25.57,11.03 29.87,12.13 32.97,12.13 30.07,15.03 32.57,15.03 35.07,15.03 34.67,19.93 24.07,29.03 20.07,27.53 31.57,17.53 24.07,41.53 28.07,41.53 25.07,46.03 27.07,47.53 28.57,45.53 26.07,50.53 20.11,63.68 6.61,51.18 6.61,48.18 20.61,20.68 28.01,20.58 65.5,60.5 72,57.5 75,59 46,60.5 41.56,62.47 41.69,65.24 50.76,66.58 53.29,66.11 65.9,66.4 64.1,78.9 66.9,78.9 16.9,57.2 86.8,55.3 86.8,57.1 83.21,50.22 83.31,52.92 63.67,18.03 81.57,13.13 85.37,13.33 83.57,11.23 88.37,12.83 59.77,5.33 57.1,20.7 59.6,20.7 63.2,20.7 65.8,20.7 67.2,23.9 69.8,24.3 72.3,24.3 30.9,5.5 64.07,12.53 77.27,11.23 75.07,12.33 59.87,16.63 65.97,16.63 70.57,16.33 77.57,24.33 42.77,24.63 35.07,10.03 31.77,10.53 36.27,18.43 32.2,42.5
  pour Top: 0,102 99,102 99,0 0,0
  pour Bottom: 0,102 99,102 99,0 0,0
N$18  (via drill 0.5, 0.6)
  Top 0.61: SHIFT2.10 21.04,55.73 22,56.7 29,56.7 29.9,55.8 v29.9,43.9 | v41.5,31.5 41.5,43 43.5,45 44.85,45 SHIFT3.9
  Bottom 0.61: 30.3,43.9 v29.9,43.9 35,43.9 36.1,42.8 36.1,38 41.5,32.6 v41.5,31.5
N$21  (via drill 0.5, 0.6)
  Top 0.61: SHIFT3.10 46.67,43.7 v46.68,45.88 | v73.9,49.7 77.4,53.2 77.4,60.2 SHIFT4.9
  Bottom 0.61: v73.9,49.7 64,49.7 59.5,45.2 52.6,45.2 51.92,45.88 v46.68,45.88
N$22
  Top 0.61: SHIFT4.10 75.17,62.48 75.7,63 76.6,63 78.4,61.2 78.4,52.4 74.8,48.8 74.8,25.4 76.17,24.04 SHIFT5.9
N$26  (via drill 0.6)
  Top 0.61: v31,41.2 31,58.4 32.3,59.7 32.3,71.6 v32.4,71.7
  Bottom 0.61: SHIFTOUTA.9 31.03,41.17 v31,41.2 | v32.4,71.7 31.59,70.89 SHIFTOUTB.14
N$31  (via drill 0.6)
  Top 0.61: v54.6,58.8 v54.6,63.7
  Bottom 0.61: SHIFTOUTC.9 54.6,53.43 v54.6,58.8 | v54.6,63.7 55.1,63.2 64.4,63.2 67.2,66 74.8,66 76.1,67.3 76.1,77.4 74.6,78.9 68.8,78.9 67.5,77.6 63.8,77.6 63.4,77.2 63.4,75.4 64.8,74 65.95,74 SHIFTOUTD.14
N$37  (via drill 0.6)
  Top 0.61: v41.7,80.2 v47.4,80.2 | v54.3,80.2 v71.3,80.2
  Bottom 0.61: SHIFTOUTB.9 33.34,77.23 33.6,77.5 33.6,78.4 35.1,79.9 41.4,79.9 v41.7,80.2 | SHIFTOUTC.14 46.84,49.23 46.6,49 43.1,49 41.5,50.6 41.5,57.9 45.8,62.2 64.81,62.21 67.5,64.9 75.2,64.9 77.1,66.8 77.1,77.9 74.8,80.2 v71.3,80.2 | v47.4,80.2 v54.3,80.2
N$38  (via drill 0.6)
  Top 0.61: v46.8,37.4 v46.9,31.4
  Bottom 0.61: SHIFTOUTD.9 63.99,67.62 60.6,64.3 56.1,64.3 55.5,64.9 54,64.9 52.4,63.3 45.5,63.3 40.5,58.3 40.5,50.2 46.8,43.9 v46.8,37.4 | SHIFTOUTE.14 63.52,32.38 62.55,31.4 v46.9,31.4
N$50
  Top 0.61: SHIFT2.9 19.77,43.73 22.2,41.3 22.2,27.8 22.7,27.3 28.6,27.3 29.8,26.1 29.8,19.7 29.1,19 21.4,19 20.98,18.59 SHIFT1.10
OUTA1
  Top 0.406: JP3.2 4.83,11.9 16.9,11.9 18.7,13.7 18.7,28.8 19.42,29.52 U_OCA.18
OUTA2
  Top 0.406: U_OCA.17 19.09,30.79 18,29.7 18,15.1 17.3,14.4 4.87,14.4 JP3.4
OUTA3
  Top 0.406: U_OCA.16 19.26,32.06 17.3,30.1 17.3,17.5 16.8,17 4.81,17 JP3.6
OUTA4
  Top 0.406: U_OCA.15 19.43,33.33 16.6,30.5 16.6,19.8 16.3,19.5 4.85,19.5 JP3.8
OUTA5
  Top 0.406: U_OCA.14 19.5,34.6 15.9,31 15.9,22.3 15.6,22 4.89,22 JP3.10
OUTA6
  Top 0.406: U_OCA.13 19.57,35.87 15.2,31.5 15.2,24.8 15,24.6 4.82,24.59 JP3.12
OUTA7
  Top 0.406: U_OCA.12 19.54,37.14 14.5,32.1 14.5,27.5 14.1,27.1 4.87,27.1 JP3.14
OUTA8
  Top 0.406: U_OCA.11 19.51,38.41 13.8,32.7 13.8,30.1 13.4,29.7 4.81,29.7 JP3.16
OUTB1
  Top 0.406: U_OCA1.18 18.7,65.92 18.7,38.8 12.1,32.2 4.85,32.2 JP3.18
OUTB2
  Top 0.406: U_OCA1.17 18.79,68.39 18,67.6 18,39.7 13.03,34.73 4.86,34.73 JP3.20
OUTB3
  Top 0.406: U_OCA1.16 18.96,69.66 17.3,68 17.3,59.6 13.61,55.92 4.87,55.92 JP4.2
OUTB4
  Top 0.406: U_OCA1.15 19.13,70.93 16.6,68.4 16.6,61.3 13.7,58.4 4.89,58.41 JP4.4
OUTB5
  Top 0.406: U_OCA1.14 19.1,72.2 15.9,69 15.9,62.7 14.18,60.98 4.85,60.98 JP4.6
OUTB6
  Top 0.406: U_OCA1.13 18.97,73.47 15.2,69.7 15.2,65.2 13.5,63.5 4.9,63.5 JP4.8
OUTB7
  Top 0.406: U_OCA1.12 18.94,74.74 14.5,70.3 14.5,67.2 13.34,66.04 4.9,66.04 JP4.10
OUTB8
  Top 0.406: U_OCA1.11 19.01,76.01 13.8,70.8 13.8,69 13.4,68.6 4.88,68.6 JP4.12
OUTC1
  Top 0.406: JP4.14 4.92,71.1 13,71.1 14.9,73 14.9,75.1 18.8,79 38.1,79 40.7,76.4 40.7,72.3 43.4,69.6 43.4,66.9 43,66.5 U_OCA2.18
OUTC2
  Top 0.406: JP4.16 4.86,73.7 13.1,73.7 14.1,74.7 14.1,75.4 18.4,79.7 38.5,79.7 41.5,76.7 41.5,72.6 44.27,69.83 U_OCA2.17
OUTC3
  Top 0.406: JP4.18 4.9,76.2 13.6,76.2 17.8,80.4 38.9,80.4 42.3,77 42.3,72.9 45.1,70.1 45.1,64.4 45.54,63.96 U_OCA2.16
OUTC4
  Top 0.406: JP4.20 4.91,78.73 12.63,78.73 15,81.1 39.4,81.1 43.1,77.4 43.1,73.2 45.9,70.4 45.9,64.7 46.81,63.79 U_OCA2.15
OUTC5
  Top 0.406: JP5.2 94.39,90 82.7,90 77,84.3 72.7,84.3 72.1,83.7 52.8,83.7 46.7,77.6 46.7,65.5 48.08,64.12 U_OCA2.14
OUTC6
  Top 0.406: JP5.4 94.45,87.4 81.6,87.4 77.7,83.5 73.2,83.5 72.6,82.9 53.1,82.9 47.5,77.3 47.5,65.8 49.35,63.95 U_OCA2.13
OUTC7
  Top 0.406: JP5.6 94.47,84.84 80.84,84.84 78.7,82.7 73.8,82.7 73.2,82.1 53.4,82.1 48.3,77 48.3,66.1 50.62,63.78 U_OCA2.12
OUTC8
  Top 0.406: JP5.8 94.47,82.3 83.8,82.3 83.7,82.4 79.6,82.4 79.1,81.9 74.3,81.9 73.7,81.3 53.7,81.3 49.1,76.7 49.1,66.4 51.89,63.61 U_OCA2.11
OUTD1
  Top 0.406: U_OCA3.18 84.04,77.74 86.05,79.75 94.48,79.75 JP5.10
OUTD2
  Top 0.406: U_OCA3.17 85.07,76.47 85.8,77.2 94.49,77.2 JP5.12
OUTD3
  Top 0.406: U_OCA3.16 85.5,75.2 86.03,74.67 94.48,74.67 JP5.14
OUTD4
  Top 0.406: U_OCA3.15 84.17,73.93 86,72.1 94.51,72.1 JP5.16
OUTD5
  Top 0.406: U_OCA3.14 82.94,72.66 86,69.6 94.47,69.6 JP5.18
OUTD6
  Top 0.406: U_OCA3.13 81.51,71.39 85.86,67.05 94.48,67.05 JP5.20
OUTD7
  Top 0.406: U_OCA3.12 80.58,70.12 85.5,65.2 85.5,46.5 86,46 94.34,46 JP6.2
OUTD8
  Top 0.406: U_OCA3.11 80.75,68.85 84.6,65 84.6,47.3 83.7,46.4 83.7,43.5 83.86,43.33 94.47,43.33 JP6.4
OUTE1
  Top 0.406: U_OCA4.18 83.89,36.19 86,38.3 94.5,38.3 JP6.6
OUTE2
  Top 0.406: U_OCA4.17 85.32,34.92 86.1,35.7 94.44,35.7 JP6.8
OUTE3
  Top 0.406: U_OCA4.16 85.55,33.65 86,33.2 94.48,33.2 JP6.10
OUTE4
  Top 0.406: U_OCA4.15 85.02,32.38 85.4,32 85.4,31.2 85.9,30.7 94.52,30.7 JP6.12
OUTE5
  Top 0.406: U_OCA4.14 84.09,31.11 85.4,29.8 85.4,28.7 86,28.1 94.46,28.1 JP6.14
OUTE6
  Top 0.406: U_OCA4.13 83.86,29.84 84.5,29.2 84.5,26.9 85.8,25.6 94.5,25.6 JP6.16
OUTE7
  Top 0.406: U_OCA4.12 83.53,28.57 83.7,28.4 83.7,25.3 85.96,23.04 94.48,23.04 JP6.18
OUTE8
  Top 0.406: U_OCA4.11 82.5,27.3 82.9,26.9 82.9,23.7 86.1,20.5 94.48,20.5 JP6.20
PL  (via drill 0.6)
  Top 0.61: SHIFT1.1 v28.6,24.9 | SHIFT3.1 v52.7,36.1 | SHIFT5.1 v67.28,12.71 | SHIFT4.1 v67.55,52.8 | SHIFT2.1 28.66,61.95 29.2,62.5 v31.1,62.5 | v57.52,50.52 57.52,51.27 57.1,51.7 57.1,67.17 v54.86,69.41
  Top 0.813: v41.48,69.4 38.77,66.69 v38.77,40.73 38.77,25.32 39,25.1 v39,24.5 39,23 44.36,17.64 JP1.7 | v54,24 54,27 58.7,31.7 58.7,49.35 v57.52,50.52 | v53.2,77.7 53.2,71.07 v54.86,69.41
  Bottom 0.61: v28.6,24.9 29.1,24.9 31.8,22.2 37.3,22.2 39,23.9 v39,24.5 | v52.7,36.1 50.8,36.1 49.5,34.8 42.27,34.8 38.77,38.3 v38.77,40.73 | v67.28,12.71 67.28,14.32 66.3,15.3 59.2,15.3 51.3,23.2 51.3,24.7 51.8,25.2 53.5,25.2 54,24.7 v54,24 | v67.55,52.8 67.55,55.15 65.5,57.1 62.12,57.1 57.52,52.5 v57.52,50.52 | v31.1,62.5 34.58,62.5 v41.48,69.4
  Bottom 0.813: v54.86,69.41 v54.85,69.4 v41.48,69.4 | v53.2,77.7 53.5,77.4 55.5,77.4 56.9,78.8 56.9,81.5 56.3,82.1 56.3,90.4 54.7,92 48.69,92 JP2.7
Q7  (via drill 0.6)
  Top 0.61: v19.9,13.4 19.71,13.59 SHIFT1.9 | v55.5,15.06 55.5,12.9 53.1,10.5 42,10.5 v41.8,10.3
  Bottom 0.61: v19.9,13.4 33.6,13.4 36.5,10.5 41.6,10.5 v41.8,10.3 | v55.5,15.06 53.49,17.07 JP1.1
Q7_2  (via drill 0.5)
  Top 0.61: SHIFT5.10 74.89,23.8 73.8,24.9 73.8,48 70.3,51.5 67,51.5 65.9,52.6 65.9,57 63.5,59.4 63.5,74.8 60.8,77.5 v60.8,79 | v59.1,88.4 58.53,88.97 JP2.1
  Bottom 0.61: v60.8,79 60.8,86.7 v59.1,88.4
SHCP  (via drill 0.6)
  Top 0.61: v36.2,76.7 37.2,76.7 38.7,75.2 38.7,73.9 v38.41,73.61 | v61.99,53.49 61.99,53.51 60.1,55.4 60.1,71.39 v57.91,73.58
  Top 0.813: v38.41,73.61 34.8,70 34.8,25.4 34.5,25.1 v34.5,24.5 | v58.5,24 58.5,25.5 62.3,29.3 62.3,53.17 v61.99,53.49
  Bottom 0.61: SHIFTOUTA.11 32.53,37.16 35.3,34.4 35.3,27.3 34.5,26.5 v34.5,24.5 | SHIFTOUTD.11 61.33,70.17 v57.91,73.58 | SHIFTOUTE.11 64.17,28.57 62.7,27.1 62.7,24 61.5,22.8 59.3,22.8 58.5,23.6 v58.5,24 | SHIFTOUTC.11 50.65,50.45 53.8,47.3 58.59,47.2 61.99,50.6 v61.99,53.49 | SHIFTOUTB.11 34.7,74.69 36.2,76.2 v36.2,76.7
  Bottom 0.813: v57.91,73.58 57.88,73.61 v38.41,73.61 | v58.5,24 58.5,25.7 55.5,28.7 50.1,28.7 47.8,26.4 47.8,20.7 47.1,20 40.3,20 38.9,18.6 38.9,14.7 40.8,12.8 42.63,12.8 JP1.8 | v36.2,76.7 36.5,77 42.4,77 44.2,78.8 44.2,83.7 45.66,85.16 JP2.8
SR_DS  (via drill 0.6)
  Top 0.61: v31.8,27.2 31.8,23.8 32.4,23.2 32.4,20.3 39.9,12.8 47.71,12.8 JP1.4
  Bottom 0.61: SHIFTOUTA.14 32.34,33.35 33.3,32.4 33.3,28.7 v31.8,27.2
SR_DS_2  (via drill 0.5)
  Top 0.61: v65.8,24.5 64.8,25.5 64.8,56.4 62.4,58.8 62.4,74.1 59.4,77.1 v59.4,79 | v58.84,86.03 57.61,84.8 52,84.8 50.74,86.06 JP2.4
  Bottom 0.61: SHIFTOUTE.9 v65.81,24.51 v65.8,24.5 | v59.4,79 59.4,85.48 v58.84,86.03
SR_RST  (via drill 0.6)
  Top 0.61: v34.8,77.7 35,77.9 37.6,77.9 39.7,75.8 39.7,72.48 v39.42,72.2 | v60.5,52.5 60,52.5 59.1,53.4 59.1,70 v56.9,72.2
  Top 0.813: v39.42,72.2 36.1,68.88 36.1,24.6 v36,24.5 | v57,24 57,26 61.1,30.1 61.1,51.89 v60.5,52.5
  Bottom 0.61: SHIFTOUTA.10 32.87,38.44 36.3,35 36.3,26.6 36,26.3 v36,24.5 | SHIFTOUTD.10 60.2,68.89 v56.9,72.2 | SHIFTOUTE.10 64.5,27.3 63.8,26.6 63.8,23.5 62.1,21.8 58.4,21.8 57,23.2 v57,24 | SHIFTOUTC.10 51.91,50.69 54.3,48.3 58.3,48.3 60.5,50.5 v60.5,52.5 | SHIFTOUTB.10 34.06,75.97 34.8,76.7 v34.8,77.7
  Bottom 0.813: v56.9,72.2 v39.42,72.2 | v34.8,77.7 35.5,78.4 42,78.4 43,79.4 43,86.31 JP2.10 | v57,24 57,25.3 54.8,27.5 50.7,27.5 49,25.8 49,19.7 48.1,18.8 41,18.8 40.1,17.9 40.1,16 41.57,14.53 JP1.10
STCP  (via drill 0.6)
  Top 0.61: v63.52,54.52 63.52,54.68 61.1,57.1 61.1,72.73 v58.82,75.01
  Top 0.813: v33,24.5 32.98,24.52 32.98,25.48 33.6,26.1 33.6,70.76 33.58,70.78 v36.8,74 | v60,24 60,25 63.5,28.5 63.5,54.5 v63.52,54.52
  Bottom 0.61: SHIFTOUTA.12 32.3,35.9 34.3,33.9 34.3,27.9 33,26.6 v33,24.5 | SHIFTOUTD.12 62.4,71.44 v58.82,75.01 | SHIFTOUTE.12 63.84,29.84 61.6,27.6 61.6,24.5 61.1,24 v60,24 | SHIFTOUTC.12 49.38,50.23 53.4,46.2 59.01,46.2 63.51,50.7 63.51,54.51 v63.52,54.52 | SHIFTOUTB.12 36.23,73.42 v36.8,74
  Bottom 0.813: v58.81,75 v58.82,75.01 42.5,75.01 | v36.8,74 37.81,75.01 42.5,75.01 | v60,24 60,26.1 56.2,29.9 49.5,29.9 46.5,26.9 46.5,21.6 46.1,21.2 39.6,21.2 37.7,19.3 37.7,14.1 40.2,11.6 43.97,11.6 JP1.6 | 42.5,75.01 45.4,77.91 45.4,82.9 48.2,85.7 JP2.6
VCC  (via drill 0.5, 0.6)
  Top 0.406: R3.2 v84.7,44.6 | v82.2,45.3 82.7,44.8 82.7,44.4
  Top 0.61: R5.2 R6.2 27.05,48.95 28.66,50.55 SHIFT2.16 | R5.2 22.3,48.9 | v21.1,48.7 22.3,48.7 R5.2 | v31,65.3 30.6,65 27.6,65 | SHIFT3.16 43.3,36.09 v43.2,36 | 28.6,14.6 SHIFT1.16 28.69,16.99 30.8,19.1 30.8,26.4 30.2,27 30.2,27.8 v30.4,28 | R4.2 82.8,42 82.7,42.1 82.7,44.4 82.7,47.7 v83.3,48.3 | SHIFT4.16 64.6,64.11 v64.6,76.4 64.48,76.52 63.38,76.52 62.3,77.8 v62.3,79 | R2.2 v82,86.1 | v82.8,88.7 R1.2 | v55,32.6 55.4,32.6 56.4,33.6 56.4,47.1 52.3,51.2 44.7,51.2 44.3,50.8 v44.3,50.3 44.3,49.8 44.4,49.7 C3.1 | R7.2 13.2,77.5 v14.8,79.1 | C4.1 87.5,63.15 RN4.1
  Top 0.813: v21.9,69 25.9,65 27.6,65 | v43.2,36 43.2,27.8 48.82,22.18 | 26.9,12.9 21.8,12.9 19.51,10.61 RN1.1 11.8,10.56 C1.1 | 26.9,12.9 28.6,14.6 | SHIFT5.16 67.28,21.52 66.52,22.28 61.4,22.28 | v87.6,9.3 86.8,10.1 86.8,18.46 RN5.1 | 26.9,12.9 34.4,5.4 35.01,4.8 51.69,4.79 54.45,7.55 J2.4 | RN2.1 11.6,54.55 C2.1 | R8.2 13.65,83.05 13.1,83.6 10.4,83.6 v9.4,82.6
  Top 1.016: v55,32.6 50.9,28.5 50.9,22.28 | v87.6,9.3 61.4,9.3
  Top 1.27: 48.82,22.18 50.9,22.28 61.4,22.28 61.4,9.3
  Top 1.676: 61.4,9.3 61.44,9.34 59.67,7.55 J2.4
  Bottom 0.406: v84.7,44.6 82.9,44.6 v82.2,45.3
  Bottom 0.61: RN2.1 17.57,48.7 v21.1,48.7 | SHIFTOUTB.16 31,67.76 v31,65.3 | SHIFTOUTC.16 v44.3,50.3 | v43.2,36 43.3,36.1 v48,36.1 | v30.4,28 31.03,28.63 SHIFTOUTA.16 | v83.3,48.3 90.4,48.3 | RN4.1 90.37,63.23 90.4,63.2 | v62.3,79 62.3,92 62.2,92.1 | v82,86.1 82,87.9 v82.8,88.7 82.8,92 82.7,92.1 | C5.1 87.5,19.16 RN5.1 | SHIFTOUTD.16 64.72,76.52 v64.6,76.4
  Bottom 0.813: 9.4,81.3 9.1,81.3 8.7,80.9 8.7,57.57 RN2.1 9.4,52.35 9.4,11.4 10.19,10.61 RN1.1 | v14.8,79.1 12.6,81.3 9.4,81.3 | v14.8,79.1 14.75,79.15 | v14.8,79.1 15.6,78.3 15.6,74.8 21.4,69 v21.9,69 | 9.4,81.3 v9.4,82.6
  Bottom 1.016: v55,32.6 61.4,32.6 63.72,34.91 SHIFTOUTE.16
  Bottom 1.27: v87.6,9.3 90.4,12.1 90.4,48.3 90.4,63.2 90.4,89.7 88,92.1 82.7,92.1 62.2,92.1 58.77,92.1 J1.1

### Text on the board
Top: HA-IO-MODULE | M2M TRITRONIK | VERSION 2